# Altium schematic sheet Main.SchDoc
size A4; SheetNumber: 1; SheetTotal: 4
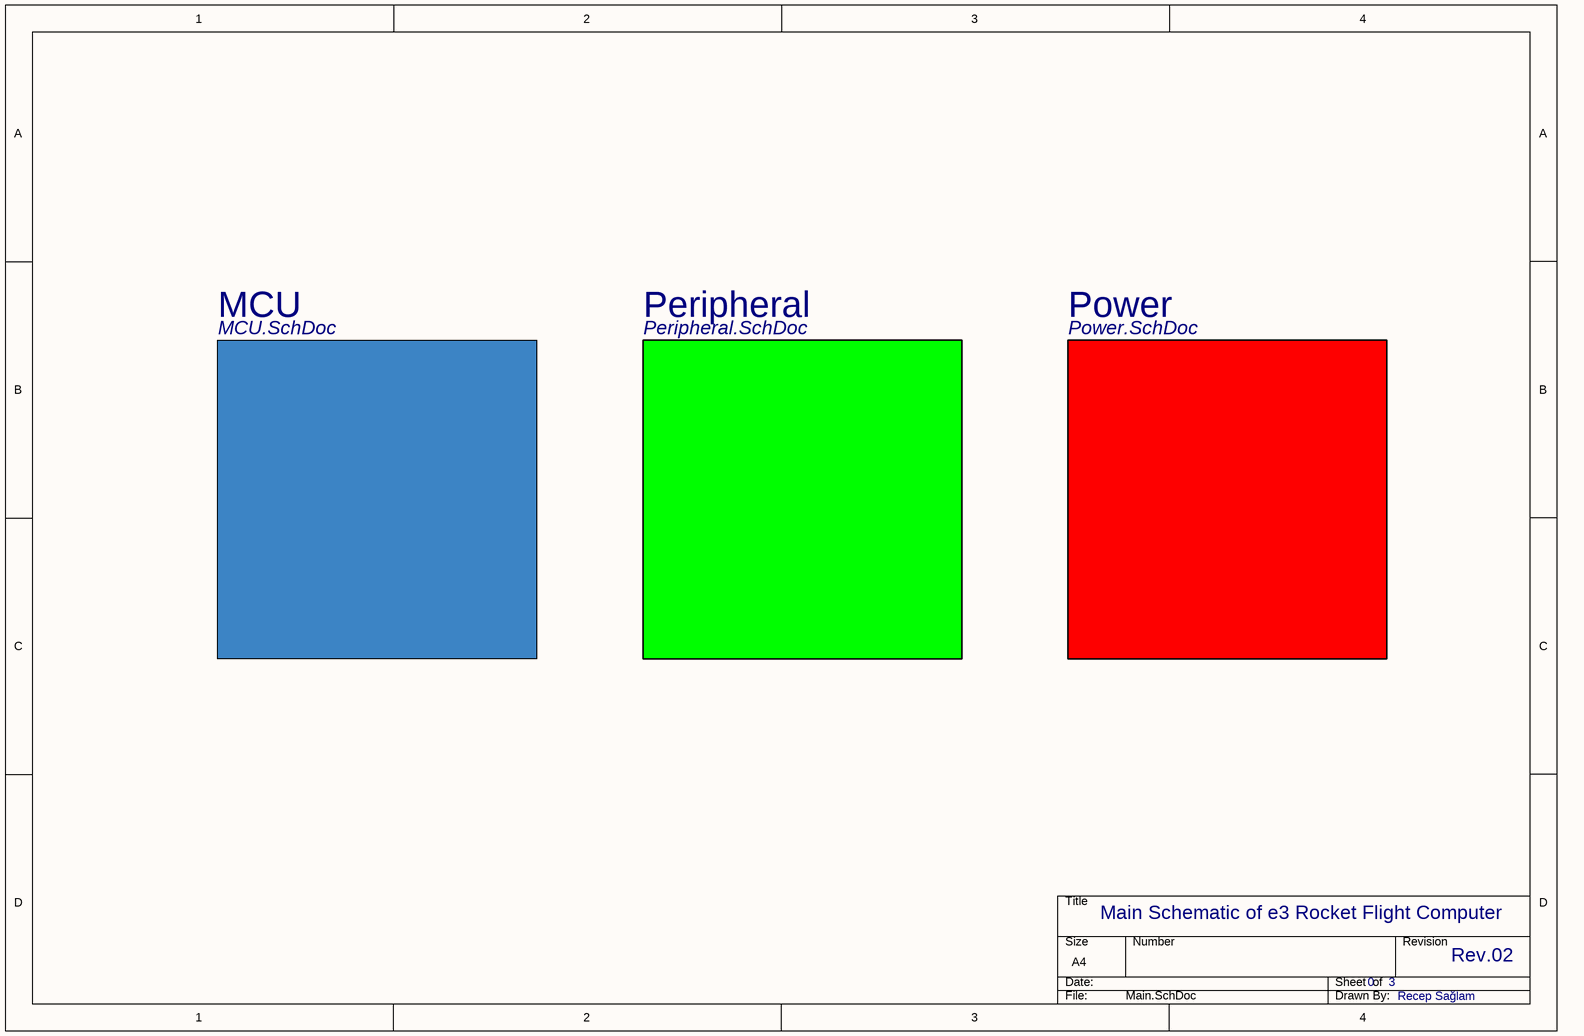
[diagram p0: Main.SchDoc]

## Sub-sheets
MCU = MCU.SchDoc: no entries
Peripheral = Peripheral.SchDoc: no entries
Power = Power.SchDoc: no entries

## Notes on the sheet
- Main Schematic of e3 Rocket Flight Computer
- 0
- 3
- Rev.02
- Recep Sağlam